# EasyEDA Pro project JLCEDA_AT_START_F456_V1.0.epro, board AT-START-F456 V1.0
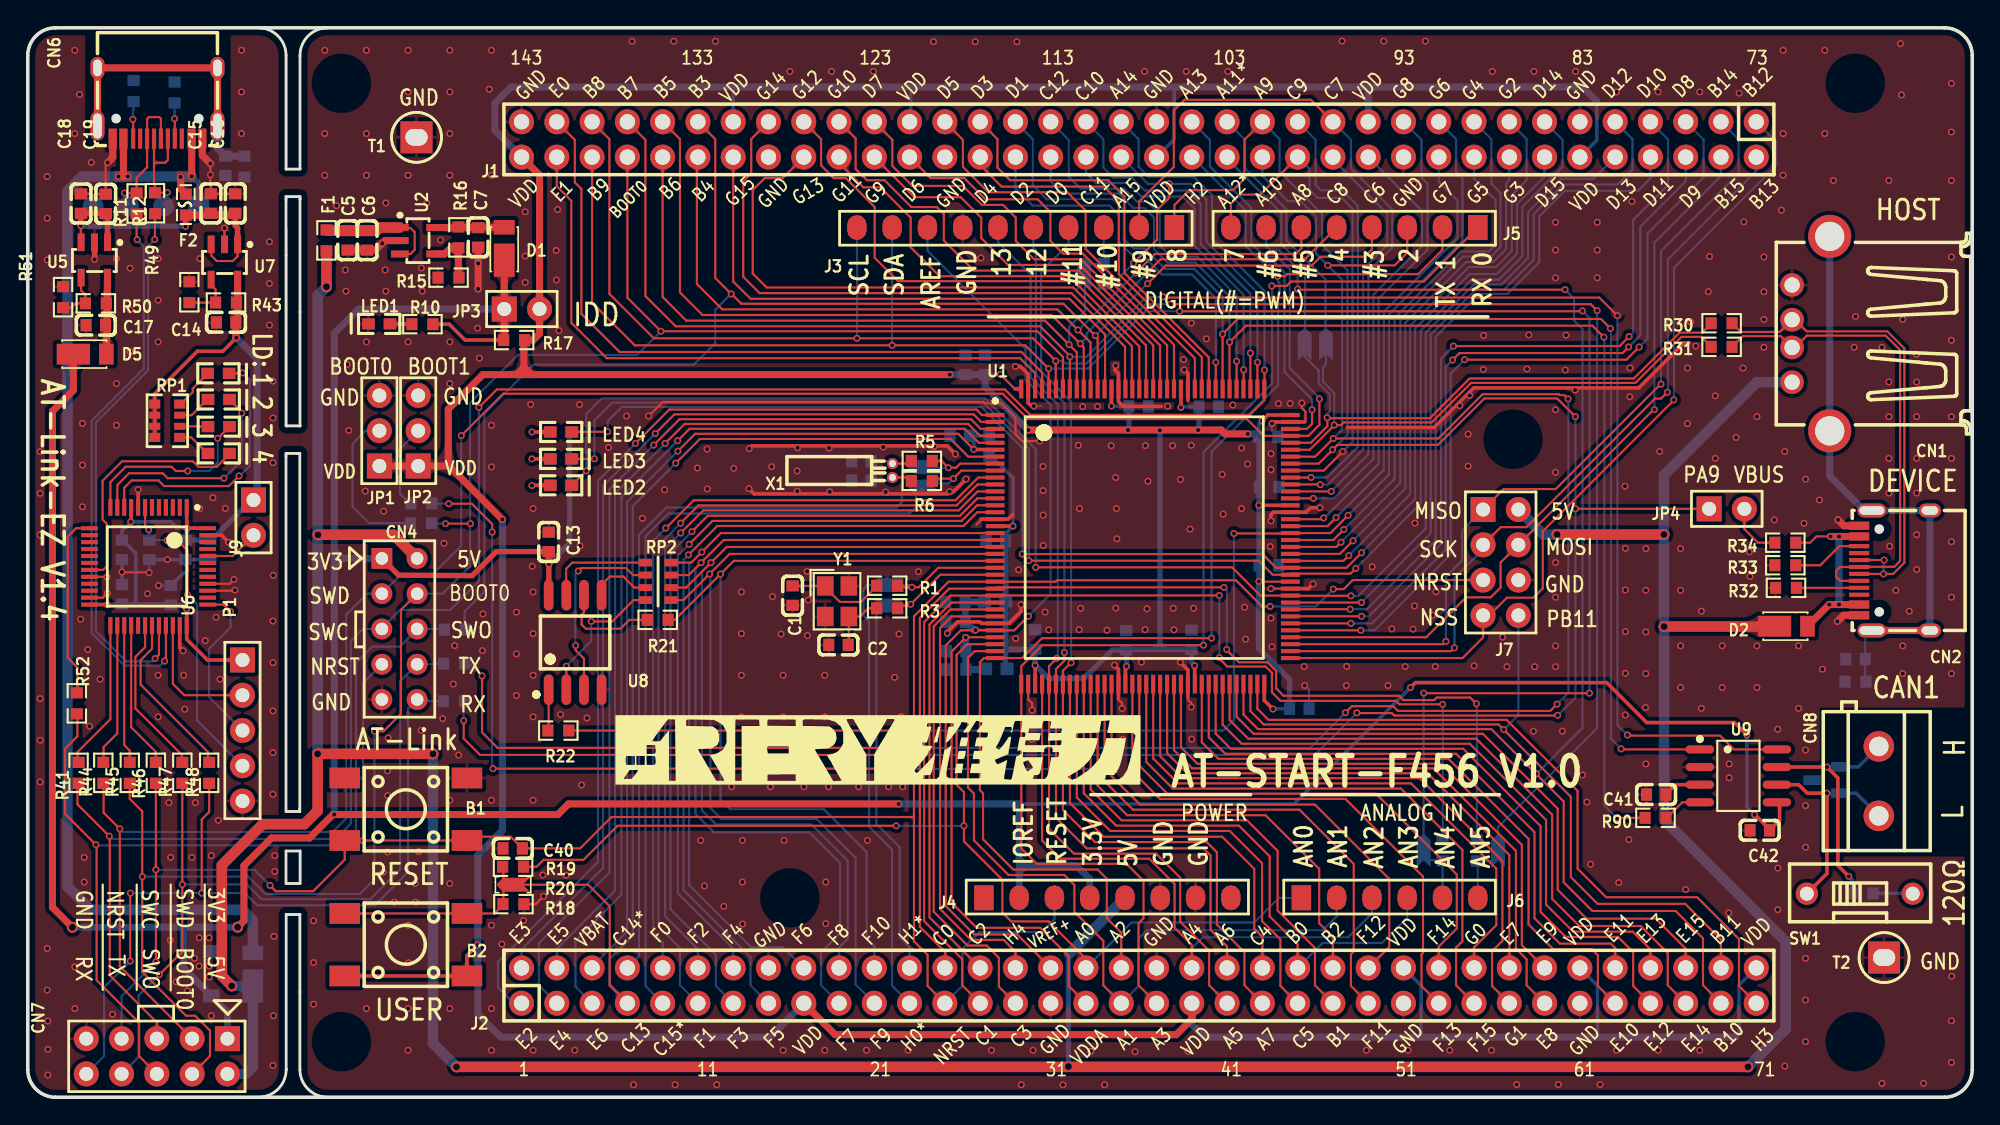
[diagram p4: board, top side]
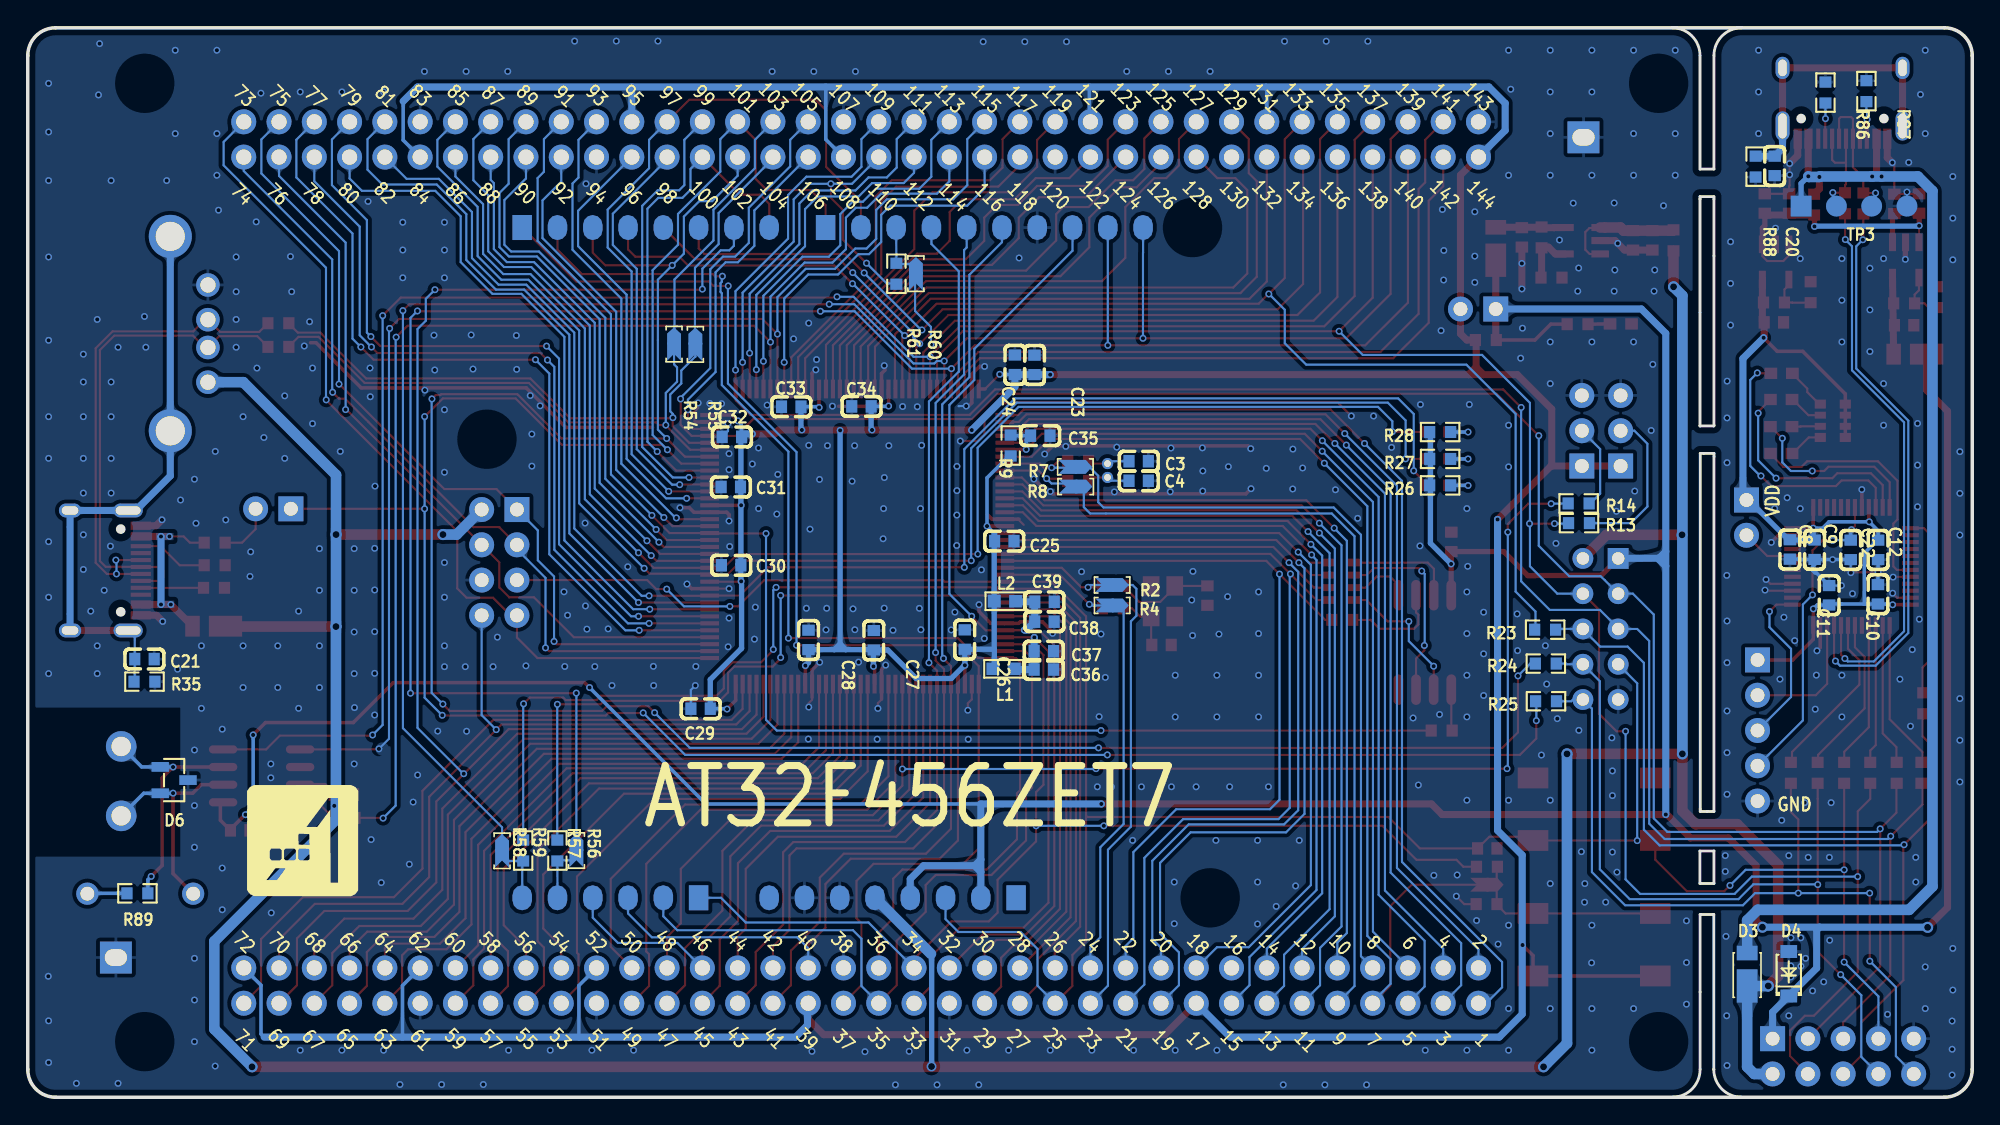
[diagram p5: board, bottom side, seen from below]

Outline 140 x 77 mm; copper layers: Top Layer, Bottom Layer. Coordinates in mm from the lower left corner of the outline.
Outline path: 16.6,77 arc(18.01,76.42) 18.6,75 18.6,66.83 19.6,66.83 19.6,75 arc(20.19,76.42) 21.6,77 ; 18.6,48.36 18.6,60.58 18.6,64.67 18.59,64.85 19.6,64.85 19.6,64.67 19.6,56.51 19.6,48.34 ; 18.6,48.36 18.62,48.34 ; 18.6,48.36 arc(18.6,48.34) 18.62,48.34 ; 18.62,48.34 19.59,48.34 ; 16.61,0 arc(18.02,0.59) 18.61,2 18.61,13.16 19.59,13.16 19.59,2 arc(20.18,0.59) 21.59,0 ; 19.59,48.34 19.6,48.34 ; 19.59,48.34 arc(19.6,48.34) 19.6,48.34 ; 0,75 0,2 arc(0.59,0.59) 2,0 138,0 arc(139.41,0.59) 140,2 140,75 arc(139.41,76.41) 138,77 2,77 arc(0.59,76.41) 0,75 ; 18.59,46.36 18.59,20.57 19.58,20.57 19.58,46.36 18.59,46.36 ; 18.59,17.73 18.59,15.39 19.61,15.39 19.61,17.73 18.59,17.73
Stack: Top Layer 0.035mm / Dielectric1 1.51mm FR4 er 4.5 / Bottom Layer 0.035mm

## Design rules (mm)
template: 自定义配置
spacing copperThickness1oz (default): track to track 0.152, other pairs 0.152 to 0.3
track width copperThickness1oz (default): min 0.152, default 0.152, max 2.54
differential pair differentialPair (default): width min 0.127, default 0.254, max 2.54; gap min 0.152, default 0.152
via viaSize (default): diameter min 0.5, default 0.5, max 0.8; hole min 0.3, default 0.3, max 0.5

## Placement (name value [footprint] x y rotation side)
B1  贴片按键6*6*5 黑色  [SW-SMD_4P-L6.0-W6.0-P4.50-LS9.0]  27.22 20.74 180 top
B2  贴片按键6*6*5 红色  [SW-SMD_4P-L6.0-W6.0-P4.50-LS9.0]  27.22 10.98 180 top
C1  15pF  [C0603]  55.07 36.12 90 top
C2  15pF  [C0603]  58.37 32.56 0 top
C3  18pF  [C0603]  60.02 45.8 0 bottom
C4  18pF  [C0603]  60.02 44.39 0 bottom
C5  10uF  [C0603]  23.03 61.7 270 top
C6  100nF  [C0603]  24.43 61.7 270 top
C7  10uF  [C0603]  32.43 61.91 270 top
C8  4.7uF  [C0603]  13.13 39.44 90 bottom
C9  100nF  [C0603]  11.35 39.42 90 bottom
C10  100nF  [C0603]  6.79 36.21 270 bottom
C11  100nF  [C0603]  10.3 36.14 270 bottom
C12  100nF  [C0603]  6.78 39.41 90 bottom
C13  100nF  [C0603]  37.51 39.99 90 top
C14  10uF  [C0603]  14.28 55.79 0 top
C15  10uF  [C0603]  13.18 64.35 270 top
C16  100nF  [C0603]  14.93 64.35 270 top
C17  10uF  [C0603]  4.9 55.59 0 top
C18  10uF  [C0603]  3.83 64.34 270 top
C19  100nF  [C0603]  5.61 64.32 270 top
C20  100nF  [C0603]  14.22 67.06 90 bottom
C21  100nF  [C0603]  131.6 31.55 180 bottom
C22  100nF  [C0603]  8.75 39.41 90 bottom
C23  4.7uF  [C0603]  67.51 52.73 90 bottom
C24  100nF  [C0603]  68.93 52.74 90 bottom
C25  100nF  [C0603]  69.69 40.04 180 bottom
C26  100nF  [C0603]  72.53 32.95 90 bottom
C27  100nF  [C0603]  79.09 32.9 90 bottom
C28  100nF  [C0603]  83.79 32.93 90 bottom
C29  100nF  [C0603]  91.56 27.97 0 bottom
C30  100nF  [C0603]  89.36 38.3 0 bottom
C31  100nF  [C0603]  89.38 43.94 0 bottom
C32  100nF  [C0603]  89.31 47.55 0 bottom
C33  100nF  [C0603]  85.03 49.72 0 bottom
C34  100nF  [C0603]  79.98 49.74 0 bottom
C35  100nF  [C0603]  67.1 47.63 180 bottom
C36  1uF  [C0603]  66.84 30.79 180 bottom
C37  100nF  [C0603]  66.84 32.11 180 bottom
C38  100nF  [C0603]  66.8 34.24 180 bottom
C39  1uF  [C0603]  66.79 35.67 180 bottom
C40  100nF  [C0603]  34.92 17.92 180 top
C41  100nF  [C0603]  117.25 21.79 0 top
C42  100nF  [C0603]  124.71 19.22 0 top
CN1  JTJ-USB-AF-08  [USB-A-TH__USB-AF-90]  128.38 54.98 90 top
CN2  -  [USB-C-SMD_TYPEC-304-BCP16]  134.41 37.93 90 top
CN4  CON10A_0  [HDR2X5]  25.49 38.8 270 top
CN6  -  [USB-C-SMD_TYPEC-304-BCP16]  9.34 71.57 180 top
CN7  CON10  [HDR2X5#2]  14.37 4.22 180 top
CN8  KF301-5.0-2P  [CONN-TH_P5.00_KF301-5.0-2P]  133.27 22.76 90 top
D1  DFLS130L-7  [POWERDI-123_L2.8-W1.8-LS3.7-RD]  34.31 61.45 90 top
D2  DFLS130L-7  [POWERDI-123_L2.8-W1.8-LS3.7-RD]  126.95 33.91 0 top
D3  DFLS130L-7  [POWERDI-123_L2.8-W1.8-LS3.7-RD]  16.21 9.19 90 bottom
D4  SMF3.3A  [SOD-123FL_L2.8-W1.8-LS3.8-RD]  13.21 8.89 90 bottom
D5  DFLS130L-7  [POWERDI-123_L2.8-W1.8-LS3.7-RD]  4.47 53.5 0 top
D6  PESD2CANFD24V-TR  [SOT-23-3_L2.9-W1.3-P1.90-LS2.4-BR]  129.46 22.83 0 bottom
F1  SMD0603B050TF  [R0603]  21.51 61.7 90 top
F2  BSMD0603-050-6V  [F0603]  11.38 64.27 270 top
J1  HDR 2X36  [HDR_2.54_2X36]  80 68.96 180 top
J2  HDR 2X36  [HDR_2.54_2X36]  80 8.04 0 top
J3  CON10  [FEMALE HEADER 1X10]  71.13 62.62 0 top
J4  CON8  [FEMALE HEADER 1X8]  77.73 14.36 0 top
J5  CON8  [FEMALE HEADER 1X8]  95.51 62.62 180 top
J6  CON6  [FEMALE HEADER 1X6]  98.05 14.36 0 top
J7  Header 4X2  [HDR2X4]  104.78 42.31 270 top
J9  1X2P_2.54M  [HDR1X2]  16.25 43 270 top
JP1  Jumper 1x3P  [HEADER 1X3]  25.31 45.45 90 top
JP2  Jumper 1x3P  [HEADER 1X3]  28.11 45.45 90 top
JP3  Jumper 1x2P  [HEADER 1X2]  34.31 56.75 0 top
JP4  Jumper 1x2P  [HEADER 1X2]  121.06 42.37 0 top
L1  0.5A,600Ω@100Mhz  [0603_L]  69.74 30.84 180 bottom
L2  0.5A,600Ω@100Mhz  [0603_L]  69.65 35.71 180 bottom
LD1  RED  [LED0603]  12.95 52.12 0 top
LD2  GREEN  [LED0603]  12.98 50.23 0 top
LD3  BLUE  [LED0603]  12.98 48.28 0 top
LD4  YELLOW  [LED0603]  12.98 46.35 0 top
LED1  RED  [LED0603]  26.08 55.69 180 top
LED2  RED  [LED0603]  37.63 44.05 0 top
LED3  YELLOW  [LED0603]  37.63 45.96 0 top
LED4  GREEN  [LED0603]  37.63 47.9 0 top
P1  Header 5  [HDR1X5]  15.46 31.48 270 top
R1  0Ω  [R0603]  61.87 36.83 0 top
R2  NC  [SB-PAD]  61.93 36.88 0 bottom
R3  0Ω  [R0603]  61.87 35.2 0 top
R4  NC  [SB-PAD]  61.93 35.41 0 bottom
R5  0Ω  [R0603]  64.37 45.82 0 top
R6  0Ω  [R0603]  64.37 44.38 0 top
R7  NC  [SB-PAD]  64.57 45.39 0 bottom
R8  NC  [SB-PAD]  64.55 43.97 0 bottom
R9  0Ω  [R0603]  69.23 46.92 270 bottom
R10  1kΩ  [R0603]  28.41 55.66 180 top
R11  0Ω  [R0603]  7.84 64.35 270 top
R12  0Ω  [R0603]  9.16 64.37 270 top
R13  10kΩ  [R0603]  28.31 41.33 0 bottom
R14  10kΩ  [R0603]  28.34 42.76 0 bottom
R15  15kΩ  [R0603]  30.29 59.01 180 top
R16  51kΩ  [R0603]  31 61.91 90 top
R17  0Ω  [R0603]  35.02 54.52 0 top
R18  100kΩ  [R0603]  34.97 13.9 180 top
R19  0Ω  [R0603]  34.94 16.59 0 top
R20  NC  [SB-PAD]  34.94 15.3 0 top
R21  33Ω  [R0603]  45.35 34.37 180 top
R22  33Ω  [R0603]  38.2 26.4 180 top
R23  470Ω  [R0603]  30.75 33.66 0 bottom
R24  470Ω  [R0603]  30.7 31.23 0 bottom
R25  470Ω  [R0603]  30.69 28.51 0 bottom
R26  1kΩ  [R0603]  38.31 44.05 180 bottom
R27  1kΩ  [R0603]  38.31 45.96 180 bottom
R28  1kΩ  [R0603]  38.31 47.9 180 bottom
R30  0Ω  [R0603]  121.96 55.73 0 top
R31  0Ω  [R0603]  121.96 54.03 0 top
R32  5.1kΩ  [R0603]  126.59 36.68 0 top
R33  5.1kΩ  [R0603]  126.54 38.3 0 top
R34  10kΩ  [R0603]  126.54 39.93 0 top
R35  1MΩ  [R0603]  131.6 29.92 0 bottom
R41  33Ω  [R0603]  3.66 23.36 270 top
R43  47kΩ  [R0603]  14.27 57.22 180 top
R44  33Ω  [R0603]  5.44 23.36 270 top
R45  33Ω  [R0603]  7.34 23.36 270 top
R46  33Ω  [R0603]  9.22 23.36 270 top
R47  33Ω  [R0603]  11.13 23.36 270 top
R48  33Ω  [R0603]  13.06 23.36 270 top
R49  15kΩ  [R0603]  11.63 57.96 90 top
R50  51kΩ  [R0603]  4.9 57.16 180 top
R51  15kΩ  [R0603]  2.54 57.61 90 top
R52  33Ω  [R0603]  3.53 28.36 270 top
R54  NC  [SB-PAD]  93.47 54.23 270 bottom
R55  NC  [SB-PAD]  91.93 54.21 270 bottom
R56  NC  [SB-PAD]  100.5 17.76 270 bottom
R57  0Ω  [R0603]  101.87 17.76 270 bottom
R58  NC  [SB-PAD]  105.85 17.74 270 bottom
R59  0Ω  [R0603]  104.33 17.76 270 bottom
R60  NC  [SB-PAD]  76.06 59.3 270 bottom
R61  0Ω  [R0603]  77.46 59.29 90 bottom
R86  5.1kΩ  [R0603]  10.57 72.34 90 bottom
R87  5.1kΩ  [R0603]  7.62 72.44 90 bottom
R88  1MΩ  [R0603]  15.6 67 270 bottom
R89  120Ω  [R0603]  132.11 14.68 180 bottom
R90  330Ω  [R0603]  117.2 20.12 0 top
RP1  1kΩ  [RES-ARRAY-SMD_0603-8P-L3.2-W1.6-BL]  10.04 48.71 270 top
RP2  33R  [0603*4,8P4R]  46.32 35.79 90 top
SW1  DSWB01LHGET  [SW-TH_DSWB01LHGET]  131.9 14.66 90 top
T1  TESTPOINT TP-5006  [TESTHOOK]  27.99 69.12 0 top
T2  TESTPOINT TP-5006  [TESTHOOK]  133.66 10.06 0 top
TP3  1X4P_2.54F  [HDR1X4 - TOP]  12.32 64.16 0 bottom
U1  AT32F457ZET7  [LQFP144_20*20]  80.28 40.37 0 top
U2  RT9080N-08GJ5  [SOT-23-5]  28.44 60.08 0 top
U5  RT9080N-08GJ5  [SOT-23-5]  3.2 59.9 270 top
U6  AT32F403ACCT7  [LQFP48 - 2]  11.45 42.47 270 top
U7  RT9080N-08GJ5  [SOT-23-5]  12.57 59.76 270 top
U8  EN25QH128A-104HIP  [SOIC-8_208MIL]  39.41 32.75 0 top
U9  MCP2562FD-E/SN  [SOIC-8_L4.9-W3.9-P1.27-LS6.0-BL]  123.16 23.14 270 top
X1  32.768kHz  [OSC-TH_BD2.0-P0.70-D0.3]  62.26 45.12 0 top
Y1  8MHz  [CRYSTAL-SMD_4P-L3.2-W2.5-BL]  58.27 35.71 270 top

## Footprints (pads in the part's own frame, mm; a bottom-side part is the same pattern mirrored in y, then rotated)
0603*4,8P4R
  rect 0.55x0.95 smd: 1(0,0) 4(2.7,0) 5(2.7,1.85) 8(0,1.85)
  rect 0.5x0.95 smd: 2(0.9,0) 3(1.8,0) 6(1.8,1.85) 7(0.9,1.85)
0603_L
  rect 0.93x0.9 smd: 1(-0.77,0) 2(0.77,0)
C0603
  rect 0.8x0.9 smd: 1(-0.7,0) 2(0.7,0)
CONN-TH_P5.00_KF301-5.0-2P
  round 2.2 hole 1.4: 1(-2.5,0) 2(2.5,0)
CRYSTAL-SMD_4P-L3.2-W2.5-BL
  rect 1.4x1.2 smd: 1(-1.1,-0.85) 2(1.1,-0.85) 3(1.1,0.85) 4(-1.1,0.85)
F0603
  rect 0.806x0.864 smd: 1(-0.753,0) 2(0.753,0)
FEMALE HEADER 1X6
  custom 1.4x1.8 hole 0.7x1: 1(-6.35,0) 2(-3.81,0) 3(-1.27,0) 4(1.27,0) 5(3.81,0) 6(6.35,0)
FEMALE HEADER 1X8
  custom 1.4x1.8 hole 0.7x1: 1(-8.89,0) 2(-6.35,0) 3(-3.81,0) 4(-1.27,0) 5(1.27,0) 6(3.81,0) 7(6.35,0) 8(8.89,0)
FEMALE HEADER 1X10
  custom 1.4x1.8 hole 0.7x1: 1(11.43,0) 2(8.89,0) 3(6.35,0) 4(3.81,0) 5(1.27,0) 6(-1.27,0) 7(-3.81,0) 8(-6.35,0) 9(-8.89,0) 10(-11.43,0)
HDR1X2
  rect 1.8x1.8 hole 1: 1(0,0)
  round 1.8 hole 1: 2(2.54,0)
HDR1X4 - TOP
  rect 1.5x1.5 smd: 1(0,0)
  round 1.5 smd: 2(-2.54,0) 3(-5.08,0) 4(-7.62,0)
HDR1X5
  rect 1.8x1.8 hole 1: 1(0,0)
  round 1.8 hole 1: 2(2.54,0) 3(5.08,0) 4(7.62,0) 5(10.16,0)
HDR2X4
  rect 1.8x1.8 hole 1.005x1: 1(0,0)
  round 1.8 hole 1.005x1: 2(0,2.54) 3(2.54,0) 4(2.54,2.54) 5(5.08,0) 6(5.08,2.54) 7(7.62,0) 8(7.62,2.54)
HDR2X5
  rect 1.5x1.5 hole 0.9: 1(0,0)
  round 1.5 hole 0.9: 2(0,2.54) 3(2.54,0) 4(2.54,2.54) 5(5.08,0) 6(5.08,2.54) 7(7.62,0) 8(7.62,2.54) 9(10.16,0) 10(10.16,2.54)
HDR2X5#2
  rect 1.8x1.8 hole 1: 1(0,0)
  round 1.8 hole 1: 2(0,2.54) 3(2.54,0) 4(2.54,2.54) 5(5.08,0) 6(5.08,2.54) 7(7.62,0) 8(7.62,2.54) 9(10.16,0) 10(10.16,2.54)
HDR_2.54_2X36
  round 1.8 hole 1.1: 1(-44.45,-1.27) 2(-44.45,1.27) 3(-41.91,-1.27) 4(-41.91,1.27) 5(-39.37,-1.27) 6(-39.37,1.27) 7(-36.83,-1.27) 8(-36.83,1.27) 9(-34.29,-1.27) 10(-34.29,1.27) 11(-31.75,-1.27) 12(-31.75,1.27) 13(-29.21,-1.27) 14(-29.21,1.27) 15(-26.67,-1.27) 16(-26.67,1.27) 17(-24.13,-1.27) 18(-24.13,1.27) 19(-21.59,-1.27) 20(-21.59,1.27) 21(-19.05,-1.27) 22(-19.05,1.27) 23(-16.51,-1.27) 24(-16.51,1.27) 25(-13.97,-1.27) 26(-13.97,1.27) 27(-11.43,-1.27) 28(-11.43,1.27) 29(-8.89,-1.27) 30(-8.89,1.27) 31(-6.35,-1.27) 32(-6.35,1.27) 33(-3.81,-1.27) 34(-3.81,1.27) 35(-1.27,-1.27) 36(-1.27,1.27) 37(1.27,-1.27) 38(1.27,1.27) 39(3.81,-1.27) 40(3.81,1.27) 41(6.35,-1.27) 42(6.35,1.27) 43(8.89,-1.27) 44(8.89,1.27) 45(11.43,-1.27) 46(11.43,1.27) 47(13.97,-1.27) 48(13.97,1.27) 49(16.51,-1.27) 50(16.51,1.27) 51(19.05,-1.27) 52(19.05,1.27) 53(21.59,-1.27) 54(21.59,1.27) 55(24.13,-1.27) 56(24.13,1.27) 57(26.67,-1.27) 58(26.67,1.27) 59(29.21,-1.27) 60(29.21,1.27) 61(31.75,-1.27) 62(31.75,1.27) 63(34.29,-1.27) 64(34.29,1.27) 65(36.83,-1.27) 66(36.83,1.27) 67(39.37,-1.27) 68(39.37,1.27) 69(41.91,-1.27) 70(41.91,1.27) 71(44.45,-1.27) 72(44.45,1.27)
HEADER 1X2
  rect 1.8x1.8 hole 1.005x1: 1(0,0)
  round 1.8 hole 1.005x1: 2(2.54,0)
HEADER 1X3
  rect 1.8x1.8 hole 1.005x1: 1(0,0)
  round 1.8 hole 1.005x1: 2(2.54,0) 3(5.08,0)
LED0603
  rect 0.914x0.813 smd: 1(-0.001,0.005) 2(1.548,0.005)
LQFP48 - 2
  rect 1.2x0.3 smd: 1(0,0) 2(0,-0.5) 3(0,-1) 4(0,-1.5) 5(0,-2) 6(0,-2.5) 7(0,-3) 8(0,-3.5) 9(0,-4) 10(0,-4.5) 11(0,-5) 12(0,-5.5) 25(8.5,-5.5) 26(8.5,-5) 27(8.5,-4.5) 28(8.5,-4) 29(8.5,-3.5) 30(8.5,-3) 31(8.5,-2.5) 32(8.5,-2) 33(8.5,-1.5) 34(8.5,-1) 35(8.5,-0.5) 36(8.5,0)
  rect 0.3x1.2 smd: 13(1.5,-7) 14(2,-7) 15(2.5,-7) 16(3,-7) 17(3.5,-7) 18(4,-7) 19(4.5,-7) 20(5,-7) 21(5.5,-7) 22(6,-7) 23(6.5,-7) 24(7,-7) 37(7,1.5) 38(6.5,1.5) 39(6,1.5) 40(5.5,1.5) 41(5,1.5) 42(4.5,1.5) 43(4,1.5) 44(3.5,1.5) 45(3,1.5) 46(2.5,1.5) 47(2,1.5) 48(1.5,1.5)
LQFP144_20*20
  rect 1.35x0.3 smd: 1(-10.625,8.75) 2(-10.625,8.25) 3(-10.625,7.75) 4(-10.625,7.25) 5(-10.625,6.75) 6(-10.625,6.25) 7(-10.625,5.75) 8(-10.625,5.25) 9(-10.625,4.75) 10(-10.625,4.25) 11(-10.625,3.75) 12(-10.625,3.25) 13(-10.625,2.75) 14(-10.625,2.25) 15(-10.625,1.75) 16(-10.625,1.25) 17(-10.625,0.75) 18(-10.625,0.25) 19(-10.625,-0.25) 20(-10.625,-0.75) 21(-10.625,-1.25) 22(-10.625,-1.75) 23(-10.625,-2.25) 24(-10.625,-2.75) 25(-10.625,-3.25) 26(-10.625,-3.75) 27(-10.625,-4.25) 28(-10.625,-4.75) 29(-10.625,-5.25) 30(-10.625,-5.75) 31(-10.625,-6.25) 32(-10.625,-6.75) 33(-10.625,-7.25) 34(-10.625,-7.75) 35(-10.625,-8.25) 36(-10.625,-8.75) 73(10.625,-8.75) 74(10.625,-8.25) 75(10.625,-7.75) 76(10.625,-7.25) 77(10.625,-6.75) 78(10.625,-6.25) 79(10.625,-5.75) 80(10.625,-5.25) 81(10.625,-4.75) 82(10.625,-4.25) 83(10.625,-3.75) 84(10.625,-3.25) 85(10.625,-2.75) 86(10.625,-2.25) 87(10.625,-1.75) 88(10.625,-1.25) 89(10.625,-0.75) 90(10.625,-0.25) 91(10.625,0.25) 92(10.625,0.75) 93(10.625,1.25) 94(10.625,1.75) 95(10.625,2.25) 96(10.625,2.75) 97(10.625,3.25) 98(10.625,3.75) 99(10.625,4.25) 100(10.625,4.75) 101(10.625,5.25) 102(10.625,5.75) 103(10.625,6.25) 104(10.625,6.75) 105(10.625,7.25) 106(10.625,7.75) 107(10.625,8.25) 108(10.625,8.75)
  rect 0.3x1.35 smd: 37(-8.75,-10.625) 38(-8.25,-10.625) 39(-7.75,-10.625) 40(-7.25,-10.625) 41(-6.75,-10.625) 42(-6.25,-10.625) 43(-5.75,-10.625) 44(-5.25,-10.625) 45(-4.75,-10.625) 46(-4.25,-10.625) 47(-3.75,-10.625) 48(-3.25,-10.625) 49(-2.75,-10.625) 50(-2.25,-10.625) 51(-1.75,-10.625) 52(-1.25,-10.625) 53(-0.75,-10.625) 54(-0.25,-10.625) 55(0.25,-10.625) 56(0.75,-10.625) 57(1.25,-10.625) 58(1.75,-10.625) 59(2.25,-10.625) 60(2.75,-10.625) 61(3.25,-10.625) 62(3.75,-10.625) 63(4.25,-10.625) 64(4.75,-10.625) 65(5.25,-10.625) 66(5.75,-10.625) 67(6.25,-10.625) 68(6.75,-10.625) 69(7.25,-10.625) 70(7.75,-10.625) 71(8.25,-10.625) 72(8.75,-10.625) 109(8.75,10.625) 110(8.25,10.625) 111(7.75,10.625) 112(7.25,10.625) 113(6.75,10.625) 114(6.25,10.625) 115(5.75,10.625) 116(5.25,10.625) 117(4.75,10.625) 118(4.25,10.625) 119(3.75,10.625) 120(3.25,10.625) 121(2.75,10.625) 122(2.25,10.625) 123(1.75,10.625) 124(1.25,10.625) 125(0.75,10.625) 126(0.25,10.625) 127(-0.25,10.625) 128(-0.75,10.625) 129(-1.25,10.625) 130(-1.75,10.625) 131(-2.25,10.625) 132(-2.75,10.625) 133(-3.25,10.625) 134(-3.75,10.625) 135(-4.25,10.625) 136(-4.75,10.625) 137(-5.25,10.625) 138(-5.75,10.625) 139(-6.25,10.625) 140(-6.75,10.625) 141(-7.25,10.625) 142(-7.75,10.625) 143(-8.25,10.625) 144(-8.75,10.625)
OSC-TH_BD2.0-P0.70-D0.3
  round 0.8 hole 0.5: 1(0,0.5) 2(0,-0.5)
POWERDI-123_L2.8-W1.8-LS3.7-RD
  rect 2.4x1.5 smd: 1(-1.188,0)
  rect 1.05x1.5 smd: 2(1.188,0)
R0603
  rect 0.806x0.864 smd: 1(-0.753,0) 2(0.753,0)
RES-ARRAY-SMD_0603-8P-L3.2-W1.6-BL
  rect 0.65x0.8 smd: 1(-1.2,-0.9) 4(1.2,-0.9) 5(1.2,0.9) 8(-1.2,0.9)
  rect 0.5x0.8 smd: 2(-0.4,-0.9) 3(0.4,-0.9) 6(0.4,0.9) 7(-0.4,0.9)
SB-PAD
  custom 1.226x1 smd: 1(-0.587,0)
  custom 1.319x1 smd: 2(0.54,0)
SOD-123FL_L2.8-W1.8-LS3.8-RD
  rect 0.93x1.2 smd: 1(-1.6,0) 2(1.6,0)
SOIC-8_208MIL
  oval 0.7x2.2 smd: 1(-1.905,-3.4) 2(-0.635,-3.4) 3(0.635,-3.4) 4(1.905,-3.4) 5(1.905,3.4) 6(0.635,3.4) 7(-0.635,3.4) 8(-1.905,3.4)
SOIC-8_L4.9-W3.9-P1.27-LS6.0-BL
  oval 0.588x2.045 smd: 1(-1.905,-2.772) 2(-0.635,-2.772) 3(0.635,-2.772) 4(1.905,-2.772) 5(1.905,2.772) 6(0.635,2.772) 7(-0.635,2.772) 8(-1.905,2.772)
SOT-23-3_L2.9-W1.3-P1.90-LS2.4-BR
  rect 1.25x0.7 smd: 1(1,-0.95) 2(1,0.95) 3(-1,0)
SOT-23-5
  rect 1.27x0.508 smd: 1(-1.651,2.54) 2(-1.651,1.6) 3(-1.651,0.635) 4(0.889,0.635) 5(0.889,2.54)
SW-SMD_4P-L6.0-W6.0-P4.50-LS9.0
  rect 2.2x1.5 smd: 1(-4.4,2.25) 2(-4.4,-2.25) 3(4.4,2.25) 4(4.4,-2.25)
SW-TH_DSWB01LHGET
  round 1.6 hole 1: 1(0,3.81) 2(0,-3.81)
TESTHOOK
  rect 2.3x2.3 hole 1.6x1.2: 1(0,0)
USB-A-TH__USB-AF-90
  round 1.7 hole 1.1: 1(-3.5,1.355) 2(-1,1.355) 3(1,1.355) 4(3.5,1.355)
  round 3.1 hole 2.1: SH1(7,-1.355) SH2(-7,-1.355)
USB-C-SMD_TYPEC-304-BCP16
  oval 1.001x2.1 hole 0.6x1.801: 13(-4.321,1.633) 14(4.321,1.633)
  oval 1.001x1.6 hole 0.6x1.199: 15(-4.321,-2.547) 16(4.321,-2.547)
  rect 0.6x1.45 smd: A1B12(-3.226,2.547) A4B9(-2.451,2.547) B1A12(3.22,2.547) B4A9(2.451,2.547)
  rect 0.299x1.45 smd: A5(-1.25,2.547) A6(-0.249,2.547) A7(0.249,2.547) A8(1.25,2.547) B5(1.75,2.547) B6(0.75,2.547) B7(-0.75,2.547) B8(-1.75,2.547)

## Nets
As in the schematic.

Pads without a net: CN2 A8 B8; CN6 A8 B8; J4 1 8; U6 2 3 4 5 6 14 15 16 17 18 21 22 29 38 41 42 43 45 46

## Via types
v1: diameter 0.5, hole 0.3, Top Layer to Bottom Layer, 364 vias
v2: diameter 0.5, hole 0.299, Top Layer to Bottom Layer, 419 vias
v3: diameter 0.8, hole 0.5, Top Layer to Bottom Layer, 12 vias
v4: diameter 0.7, hole 0.5, Top Layer to Bottom Layer, 1 via

## Routing (per net, layer and track width the routed paths; a pad name or vN(x,y) marks a point on that pad's centre or on a via; arc(x,y) is an arc through that point)
3V3: length 298.7
  Top Layer w0.254: v1(124.33,20.34) 124.36,20.34 125.26,19.44 125.26,19.37 C42.2 126.13,19.94 126.13,21.04 125.94,21.23 ; 29.11,55.66 30.34,55.66 31.49,54.52 34.32,54.52 ; v1(99.55,29.5) 99.91,29.85 113.69,29.85 116.56,26.97 122.89,26.97 v1(123.77,26.09)
  Top Layer w0.381: U8.8 v1(37.52,38.4) 37.51,38.41 37.51,39.29 33.73,39.29 32,37.56 26.69,37.59 25.49,38.8
  Top Layer w0.508: v3(3.21,12.23) 1.78,13.67 1.78,49.4 3.28,50.9 3.28,53.11 ; 34.3,60.26 34.3,54.53 34.32,54.52 ; 3.28,53.11 3.28,53.5 ; 3.28,53.11 3.79,53.62 ; v3(15.11,12.24) 15.56,12.7 15.56,16.68 17.55,18.67 20.29,18.67 21.98,20.35 v1(22.06,20.35) 38.17,20.35 38.93,21.12 v1(62.7,21.12)
  Bottom Layer w0.254: v1(124.33,20.34) 123.77,20.9 v1(123.77,26.09) ; 71.38,21.12 91.17,21.12 v1(99.55,29.5)
  Bottom Layer w0.381: v1(37.52,38.4) 39.01,39.89 39.01,47.9
  Bottom Layer w0.508: 71.38,17.12 71.38,16.21 ; 71.38,17.12 71.38,21.12 v1(62.7,21.12) ; 71.38,17.12 71.83,16.67 ; 71.38,16.21 71.83,16.67 ; 71.38,16.21 71.38,14.36 ; 22.06,39.3 22.06,55 23.82,56.75 34.3,56.75 ; 22.06,39.3 22.06,38.23 ; 22.06,39.3 22.55,38.81 ; 25.49,38.8 22.55,38.81 ; 22.55,38.81 22.55,38.72 22.06,38.23 ; 71.83,16.67 75.51,16.67 76.46,15.72 76.46,14.36 ; 22.06,38.23 v1(22.06,20.35) ; 11,12.24 3.22,12.24 v3(3.21,12.23) ; 11,12.24 11.2,12.04 11.2,9.3 D4.1 14.37,6.12 CN7.1 ; 11,12.24 v3(15.11,12.24)
5V: length 295.9
  Top Layer w0.254: U9.3 118.61,22.5 117.95,21.84 C41.2 117.95,20.99 v1(117.93,20.98)
  Top Layer w0.762: v3(117.81,33.89) 125.74,33.89 D2.1 ; v3(117.81,40.51) v3(110.11,40.51) 110.08,40.54 ; v3(29.18,24.72) v3(20.87,24.72) 20.87,20.62 19.91,19.66 16.92,19.66 13.97,16.71 13.97,8.73 v3(14.68,8.02) ; v3(123.85,2.19) v3(30.87,2.19) ; 28.03,38.8 26.33,40.5 v3(20.89,40.5) ; 21.51,60.94 21.51,58.35
  Bottom Layer w0.381: v4(74.93,2.21) 74.92,2.22 74.92,10.27 74.97,10.32
  Bottom Layer w0.762: v3(21.5,58.35) 20.87,57.72 v3(20.87,24.72) ; 29.18,24.72 29.18,3.88 v3(30.87,2.19) ; J7.2 109.12,40.51 v3(110.11,40.51) ; 127.03,51.48 124.48,51.48 117.81,44.81 v3(117.81,40.51) 117.81,33.89 v3(117.81,33.89) 117.81,19.98 126.57,11.22 126.57,4.9 v3(123.85,2.19) ; CN7.2 15.7,1.68 16.21,2.18 D3.1 14.69,8.01 v3(14.68,8.02) ; 79,14.36 74.97,10.32
GND: length 186.6
  Top Layer w0.152: 78.79,28.37 v2(78.79,27.99) ; v1(13.15,67.23) v2(13.15,66.42) 13.15,65.64 13.18,65.6 13.18,65.05 14.93,65.05 ; v2(72.31,27.86) 72.31,28.36 72.03,28.64 72.03,29.75 ; v1(5.73,36.29) 5.41,35.97 U6.23 ; v1(14.16,62.58) 14.17,62.57 U7.2 ; v1(5.75,67.29) 5.61,67.15 C19.1 5.59,65.04 C18.1 ; v2(72.86,47.25) 71.62,47.25 71.11,47.76 71.11,48.94 70.09,49.96 68.92,49.96 68.82,50.06 45.72,50.06 v2(44.7,49.05) ; v2(37.14,14.48) 36.57,13.9 R18.1 ; 78.79,28.38 78.53,28.63 78.53,29.75 ; v2(83.77,28.09) 83.77,28.38 83.53,28.62 83.53,28.79 ; v1(6.78,37.82) 6.8,37.8 8.71,37.8 v1(8.74,37.77) ; v1(5.7,37.45) 5.68,37.47 U6.20 ; v1(14.85,37.28) 14.54,36.97 U6.40 ; U1.83 v2(89.51,36.62) ; 68.7,41.62 68.29,41.21 ; v2(91.73,49.99) 91.73,49.62 91.99,49.37 91.99,48.67 91.94,48.62 ; U6.39 14.87,36.47 v1(14.92,36.51)
  Top Layer w0.254: v2(71.11,52.62) 71.47,52.62 72.03,52.06 U1.143 72.03,50 72.22,49.81 ; v2(89.59,48.51) 89.59,48.62 U1.107 91.94,48.62 ; U6.47 13.94,40.48 v1(14.47,39.95) ; v2(67.56,44.51) 66.66,43.61 v2(66.37,43.61) 66.21,43.44 61.91,43.44 ; 95.01,48.23 101.26,48.23 104.11,51.07 115.99,51.07 119.24,54.32 119.64,54.32 ; v2(82.98,31.32) 83.53,30.77 83.53,28.79 ; 68.63,41.62 U1.16 70.58,41.62 70.92,41.96 ; v1(7.95,43.75) 7.95,42.47 7.94,42.47 ; 83.53,50.16 83.53,52.12 83.44,52.21 ; 61.91,43.44 52.3,43.44 v2(51.93,43.81) ; 61.91,43.44 v2(61.77,43.58) ; 78.53,28.67 78.53,30.82 v2(78.23,31.11) ; 66.26,33.55 66.94,34.23 68.55,34.23 68.66,34.12 U1.31 70.66,34.12 71.51,34.97 v2(71.51,35.46) ; v2(66.79,46.31) 66.2,46.9 52.14,46.9 v2(51.95,46.7) ; v1(11.18,32.15) 10.95,32.38 U6.35 ; 81.62,49.75 78.86,49.75 78.53,50.08 78.53,52.11 78.29,52.35 78.29,52.72 ; v2(89.51,41.49) 89.5,41.5 89.5,41.94 89.68,42.12 U1.94 92.04,42.12 92.36,42.44 v1(93.04,42.44) ; 90.91,36.62 92.2,36.62 v2(92.54,36.95)
  Top Layer w0.381: 4.8,61.56 4.82,61.54 v1(4.82,60.33)
  Top Layer w0.508: v2(130.29,34.26) 130.73,34.7 CN2.A1B12 ; CN6.B1A12 6.12,67.66 v1(5.75,67.29) ; CN6.A1B12 12.56,67.81 v1(13.15,67.23) ; U2.2 25.72,61.68 v2(25.52,61.48) 25.04,61 C6.2 C5.2 ; v2(130.34,41.57) 130.77,41.15 CN2.B1A12 ; 32.43,58.2 v2(32.43,58.2) v2(32.43,60.04) 32.43,61.21
  Bottom Layer w0.152: v2(72.43,49.77) 72.96,49.77 72.98,49.75 ; v1(8.74,37.77) 8.75,37.78 C22.1 ; v2(4.7,65.18) TP3.4 ; v2(91.94,29.64) 92.26,29.32 C29.2 ; C32.2 89.59,47.97 v2(89.59,48.51) ; C11.1 v1(9.42,36.84)
  Bottom Layer w0.254: C11.1 11.22,37.75 11.32,37.75 11.5,37.93 11.5,38.19 11.35,38.34 11.35,38.71 ; C22.1 v1(10.05,38.71) 11.35,38.71 ; 11.35,38.71 12.39,38.71 12.42,38.74 C8.1 ; 11.35,38.71 C9.1 ; C10.1 6.79,37.81 v1(6.78,37.82) C12.1
  vias: v1(57.69,46.74) v1(83.77,55.74) v1(84.86,54.6) v1(103.11,49.78) v1(103.82,50.52) v1(106.5,31) v1(108.41,26.35) v1(108.5,31) v1(110,63) v1(110,61) v1(110,59) v1(110,49.5) v1(110,45) v1(110,38.5) v1(110,36) v1(110,32.5) v1(110,31) v1(110.7,52.36) v1(110.75,54.87) v1(111.41,50.91) v1(111.93,23.2) v1(112.26,21.25) v1(112.53,16.78) v1(113,63) v1(113,61) v1(113,59) v1(115,44) v1(115.02,39.52) v1(115.02,36.52) v1(115.02,33.52) v1(115.02,30.52) v1(115.02,27.52) v1(115.28,18.55) v1(115.36,52.5) v1(115.34,50.44) v1(115.5,64.5) v1(116.5,39.5) v1(116.5,36.5) v1(116.5,33.5) v1(116.5,30.5) v1(116.48,28.05) v1(116.5,24) v1(117.5,46.5) v1(119,39.5) v1(119,36.5) v1(119,32.5) v1(119,29.5) v1(119.5,52.5) v1(119.5,48.5) v1(119.71,55.84) v1(120.09,54.09) v1(120.5,35) v1(120.5,28) v1(121,58) v1(121.5,50.5) v1(121.5,46) v1(122,32.5) v1(122,29.5) v1(122.5,24) v1(122.5,23) v1(123,47.5) v1(123.5,52.5) v1(123.95,39.27) v1(124,37.5) v1(124.5,49) v1(124.5,32.5) v1(124.5,29.5) v1(125,60.5) v1(125,58) v1(125,56) v1(125,54) v1(125.75,41.57) v1(126,26.5) v1(126,16.5) v1(126,13.5) v1(126.5,46.5) v1(127.5,32.5) v1(127.5,28) v1(127.89,41.33) v1(128,44.5) v1(128,25) v1(128,21) v1(128,18) v1(128,10) v1(128,7) v1(128,4) v1(129,43) v1(130,66) v1(131.5,54) v1(131.6,56.22) v1(133.5,54) v1(133.5,1) v1(134,66) v1(134,51.5) v1(134,49) v1(134,46) v1(134,43.5) v1(134.05,39.68) v1(134.5,36.5) v1(135,56) v1(135,32.5) v1(135,30.5) v1(135.47,35) v1(136,53.5) v1(136,51.5) v1(136,49) v1(136,46) v1(136,43.5) v1(136,40.5) v1(136,38) v1(136.5,1) v1(138.5,73) v1(138.5,69.5) v1(138.5,66) v1(138.5,60.5) v1(138.5,54.5) v1(138.5,49) v1(138.5,46) v1(138.5,40) v1(138.5,36) v1(138.5,30.5) v1(138.5,5.5) v1(138.5,2.5) v2(0.89,46.48) v2(0.89,43.48) v2(0.89,40.48) v2(0.89,28.7) v2(0.89,25.7) v2(0.89,22.7) v2(1.4,66.29) v2(1.4,63.29) v2(1.4,60.29) v2(1.4,10.72) v2(1.4,7.72) v2(1.45,5.49) v2(1.45,3.45) v2(1.45,1.6) v2(3.38,75.38) v2(3.38,69.38) v2(3.38,9.38) v2(3.38,6.38) v2(3.72,72.2) v2(3.81,34.42) v2(3.94,48.51) v2(3.94,45.51) v2(3.94,42.51) v2(4.06,17.27) v2(4.06,15.49) v2(4.32,32.23) v2(4.44,26.72) v2(4.57,67.31) v2(5.21,30.1) v2(6.1,5.97) v2(6.38,60.38) v2(6.38,51.38) v2(6.38,48.38) v2(7.37,59.69) v2(7.37,56.69) v2(7.37,53.69) v2(8.62,36.26) v2(9.38,60.38) v2(9.38,57.38) v2(9.38,54.38) v2(9.38,30.38) v2(9.38,27.38) v2(10.16,21.21) v2(10.29,17.27) v2(10.26,11.3) v2(10.69,8.31) v2(11.22,30.39) v2(11.3,27.94) v2(11.49,7.66) v2(11.81,17.27) v2(12,10) v2(12.06,21.21) v2(12.38,60.38) v2(12.38,42.38) v2(12.34,11.48) v2(12.33,9.44) v2(12.78,32.88) v2(13.06,11.48) v2(13.06,9.45) v2(13.06,8.66) v2(13.21,17.4) v2(13.21,5.87) v2(13.33,43.16) v2(13.56,34.56) v2(13.72,19.94) v2(13.84,30.1) v2(14.22,42.39) v2(15.38,75.38) v2(15.38,72.38) v2(15.38,69.38) v2(17.4,61.59) v2(17.4,58.59) v2(17.4,55.59) v2(17.64,51.56) v2(17.65,48.91) v2(17.65,45.69) v2(17.67,37.57) v2(17.65,34.29) v2(17.65,31.29) v2(17.65,27.81) v2(17.65,24.81) v2(17.65,21.81) v2(17.68,5.87) v2(17.65,2.29) v2(17.78,17.4) v2(17.78,16.26) v2(17.73,11.58) v2(20.57,12.7) v2(20.57,9.7) v2(20.57,6.7) v2(21.38,75.38) v2(21.38,69.38) v2(21.38,66.38) v2(22.23,64.19) v2(22.86,59.56) v2(22.91,58.04) v2(23,52.77) v2(23.11,48.01) v2(24.3,43.64) v2(24.38,75.38) v2(24.38,69.38) v2(24.38,66.38) v2(24.38,54.38) v2(24.38,6.38) v2(25.62,42.19) v2(25.58,16.21) v2(25.78,64.39) v2(25.73,59.56) v2(25.78,58.04) v2(25.91,23.5) v2(25.91,21.72) v2(25.91,17.65) v2(25.95,25.88) v2(26.39,14.05) v2(27.38,75.38) v2(27.38,72.38) v2(27.38,66.38) v2(27.38,54.38) v2(27.38,12.38) v2(27.41,9.68) v2(27.38,6.38) v2(27.38,3.38) v2(27.89,15.38) v2(27.91,14.05) v2(28.14,17.68) v2(28.32,26.42) v2(28.34,59.7) v2(28.4,58.04) v2(28.73,64.38) v2(29.72,61.72) v2(29.88,27.26) v2(29.97,39.88) v2(30.38,75.38) v2(30.38,72.38) v2(30.38,69.38) v2(30.38,66.38) v2(30.38,54.38) v2(30.38,51.38) v2(30.38,21.38) v2(30.38,15.38) v2(30.38,6.38) v2(30.64,29.75) v2(30.73,32.51) v2(31.02,24.64) v2(32.38,55.37) v2(32.51,53.21) v2(32.77,34.8) v2(32.73,32.16) v2(33.23,72.58) v2(33.38,75.38) v2(33.38,66.38) v2(33.38,48.38) v2(33.38,45.38) v2(33.38,21.38) v2(33.38,12.38) v2(33.38,6.38) v2(33.38,3.38) v2(34.14,11.02) v2(35.18,34.92) v2(35.18,31.92) v2(35.18,28.92) v2(35.69,12.72) v2(35.81,63.75) v2(35.81,60.56) v2(35.81,58.67) v2(36.21,49.88) v2(36.32,38.23) v2(36.38,42.38) v2(36.38,36.38) v2(36.38,33.38) v2(36.38,30.38) v2(36.38,27.38) v2(36.38,21.38) v2(36.38,3.38) v2(37.08,16) v2(38.04,60.97) v2(38.06,58.84) v2(38.15,63.92) v2(38.24,55.2) v2(38.35,27.56) v2(38.76,15.98) v2(39.38,3.38) v2(39.73,49.88) v2(39.77,39.7) v2(39.88,22.48) v2(40.26,27.31) v2(41.81,46.79) v2(43.1,49.05) v2(43.51,76.03) v2(43.61,0.89) v2(44.25,41.68) v2(45.85,43.74) v2(46.51,76.03) v2(46.61,0.89) v2(48.21,45.31) v2(48.45,18.49) v2(48.72,15.21) v2(48.91,46.67) v2(48.93,43.8) v2(49.51,76.03) v2(49.61,0.89) v2(50.11,13.74) v2(50.67,22.35) v2(50.83,45.28) v2(51.38,36.38) v2(51.38,33.38) v2(51.38,30.38) v2(51.38,27.38) v2(51.45,18.49) v2(51.45,15.49) v2(51.46,12.47) v2(53.47,22.35) v2(53.56,45.4) v2(53.61,36.04) v2(54.23,33.34) v2(54.38,30.38) v2(54.38,27.38) v2(54.38,3.38) v2(54.45,18.49) v2(54.87,73.86) v2(55.4,45.09) v2(55.4,43.65) v2(55.43,46.75) v2(55.88,22.35) v2(56.11,37.86) v2(56.19,35.8) v2(56.14,33.24) v2(57.38,30.38) v2(57.38,27.38) v2(57.38,3.38) v2(57.45,15.49) v2(57.45,12.49) v2(57.66,22.35) v2(57.74,43.59) v2(57.87,73.86) v2(59.82,22.35) v2(60.38,3.38) v2(60.45,18.49) v2(60.87,73.86) v2(61.59,46.81) v2(61.98,22.35) v2(62.42,30.23) v2(62.73,33.35) v2(62.86,27.4) v2(62.99,22.35) v2(63.38,3.38) v2(64.13,37.84) v2(65.21,76) v2(65.26,46.86) v2(66.21,33.4) v2(66.38,3.38) v2(68.21,76) v2(68.62,60.43) v2(69.38,3.38) v2(71.21,76) v2(71.13,33.03) v2(71.34,37.97) v2(71.53,0.89) v2(72.29,25.77) v2(72.38,3.38) v2(73.1,45.42) v2(73.1,43.68) v2(73.11,41.92) v2(73.12,39.73) v2(73.25,34.93) v2(73.51,33.65) v2(74.53,0.89) v2(75.64,46.94) v2(75.7,33.66) v2(75.73,42.38) v2(75.81,35.2) v2(75.96,49.72) v2(76.54,3.3) v2(77.01,49.73) v2(77.53,0.89) v2(77.71,33.62) v2(78,46.91) v2(78.33,52.68) v2(78.33,44.62) v2(78.38,42.38) v2(78.42,40.21) v2(78.34,35.22) v2(78.84,25.78) v2(79.72,3.28) v2(80.19,31.33) v2(80.41,73.86) v2(80.47,46.91) v2(80.45,33.66) v2(80.58,35.16) v2(80.65,44.35) v2(82.07,49.76) v2(82.42,46.91) v2(82.48,35.2) v2(82.53,33.65) v2(83,44.48) v2(83.21,53.11) v2(83.26,52.38) v2(83.41,73.86) v2(83.54,3.3) v2(83.68,40.9) v2(83.77,46.94) v2(83.8,25.79) v2(83.94,35.2) v2(86,44.85) v2(86.07,41.99) v2(86.41,73.86) v2(86.77,49.83) v2(87.39,46.75) v2(87.38,42.38) v2(87.61,35.29) v2(87.68,32.98) v2(87.83,45.59) v2(89.51,46.34) v2(89.51,45.18) v2(89.46,39.65) v2(89.51,34.5) v2(89.58,32.43) v2(90.05,49.94) v2(90.89,49.95) v2(91.9,31.02) v2(94.63,76.04) v2(94.96,31.02) v2(94.94,29.64) v2(96.38,3.38) v2(96.8,38.19) v2(97.63,76.04) v2(97.94,29.64) v2(98.21,33.72) v2(99.17,31.01) v2(99.38,3.38) v2(99.81,65.77) v2(99.74,33.7) v2(99.87,41.34) v2(99.85,35.37) v2(100.63,76.04) v2(101.14,34.71) v2(101.39,36.39) v2(101.34,31.02) v2(102.38,3.38) v2(103.71,47.75) v2(103.7,45.44) v2(104.13,31.06) v2(104.82,54.85) v2(104.8,52.41) v2(105.38,3.38) v2(105.44,73.86) v2(106.19,33.13) v2(107.2,0.91) v2(107.94,52.43) v2(108.08,54.89) v2(108.44,73.86) v2(110.2,0.91) v2(110.48,26.36) v2(111.44,73.86) v2(113.2,0.91) v2(114.38,72.38) v2(114.38,3.38) v2(114.55,15.45) v2(117.38,72.38) v2(117.38,3.38) v2(119.37,14.95) v2(120.38,72.38) v2(120.38,3.38) v2(121.09,60.53) v2(122.47,13.28) v2(123.21,72.3) v2(123.55,63.03) v2(126.27,63.87) v2(126.38,75.38) v2(126.38,69.38) v2(126.38,66.38) v2(126.51,2.24) v2(129.22,30.82) v2(129.38,75.38) v2(129.38,69.38) v2(134.83,75.86) v2(134.91,72.17) v2(138.52,8.71)
VBAT: length 69.1
  Top Layer w0.152: U1.6 68.14,46.62 68.11,46.64 66.99,47.77 48.05,47.77 46.8,46.52
  Top Layer w0.254: 68.11,46.64 U1.6
  Bottom Layer w0.152: 46.8,46.52 43.15,42.86 43.15,11.92 40.63,9.41 J2.6 ; 69.23,47.62 69.22,47.63 C35.1
  Bottom Layer w0.254: 69.23,47.62 67.79,47.63 68.11,47.32 68.11,46.64
  vias: v1(46.8,46.52) v1(68.11,46.64)
VBUS: length 14
  Top Layer w0.152: R34.2 128.33,39.93 128.78,40.38 v2(129.8,40.38)
  Top Layer w0.508: CN2.A4B9 v2(130.41,35.48) v2(129.7,35.48) D2.2 ; CN2.B4A9 v2(129.8,40.38)
  Bottom Layer w0.508: v2(130.41,35.48) v2(130.41,40.37) 130.42,40.38
VCC: length 63.2
  Top Layer w0.254: v1(7.42,41.43) 7.45,41.46 U6.9 ; 11.44,33.97 11.44,32.97 12.93,31.48 P1.1 ; v1(15.02,54.68) 14.04,53.71 12.2,53.71 9.14,50.64 RP1.1 RP1.2 9.14,47.51 ; 11.44,42.47 11.44,41.45 11.45,41.44 v1(11.45,40.97) 11.95,40.97 11.96,40.97 12.95,40.97 ; U6.36 11.45,35.16 v1(11.44,35.16) ; v1(5.73,35.46) 5.72,35.47 4.44,35.47
  Top Layer w0.508: U7.5 15.11,55.92 C14.2 14.98,54.72 v1(15.02,54.68)
  Bottom Layer w0.152: C10.2 6.84,35.51
  Bottom Layer w0.254: v1(5.73,35.46) 6.13,35.46 6.18,35.51 C10.2 ; 7.78,35.51 9.4,35.51 9.41,35.52 10.22,35.52 C11.2 11.16,35.44 v1(11.44,35.16) ; 7.78,35.51 6.84,35.51 ; 7.78,35.51 7.77,35.52 7.77,39.17 6.83,40.11 C12.2 6.78,40.79 v1(7.42,41.43) 10.31,41.43 10.77,40.97 v1(11.45,40.97)
  Bottom Layer w0.381: v1(11.45,40.97) 11.45,40.22 11.35,40.12 13.11,40.12 C8.2 13.24,40.14 16.1,43 J9.1
  Bottom Layer w0.508: J9.1 16.51,43.26 16.51,53.19 v1(15.02,54.68)
VCC3.5V: length 5.5
  Top Layer w0.508: D5.2 U5.5
VDD: length 461.8
  Top Layer w0.152: 71.08,50.99 70.02,52.05 ; 78.02,49.77 78.02,50.98 78.03,50.99 ; 84.03,29.75 84.03,31.06 84.01,31.07 ; 90.91,37.12 88.66,37.12 v1(88.64,37.14) ; v1(83.03,49.67) 83.03,50.99 83.03,50.99
  Top Layer w0.254: v1(32.38,10.96) 31.62,10.2 B2.1 B2.3 ; v1(88.87,48.7) 89.29,49.12 U1.108 ; 79.03,29.75 79.03,30.94 v1(79.11,31.02) ; U1.17 70.93,41.12 ; 84.03,29.75 84.01,31.07 ; 71.53,50.99 71.08,50.99 ; 89.03,29.75 89.03,28.57 89.65,27.95 ; U1.95 v1(88.64,42.62) ; 78.03,50.99 78.02,49.77 ; 83.03,50.99 v1(83.03,49.67) ; 72.53,29.75 72.53,31.1 ; 90.9,37.12 U1.84
  Top Layer w0.508: 36.26,52.03 35.2,52.03 ; 36.26,52.03 66.39,52.03 ; 36.26,52.03 35.72,52.57 ; 35.2,52.03 35.72,52.57 ; 35.2,52.03 32.76,52.03 30.28,49.55 30.28,45.45 ; JP1.1 30.28,45.45 ; J1.72 36.85,66.4 JP3.2 ; 30.28,45.45 30.33,45.45 v1(34.18,41.6) ; J2.39 83.81,5.62 82.69,4.5 58.13,4.5 J2.17 ; 35.72,52.57 35.72,54.52 36.39,54.52 36.84,54.97 36.84,56.75 ; v2(87.84,47.76) 86.21,47.76 85.93,48.04 v1(84.27,48.04) v1(79.21,48.04) ; 79.22,48.04 72.04,48.04 v1(72.04,48.03)
  Bottom Layer w0.152: 89.68,27.97 89.65,27.95 ; 88.61,47.73 88.61,47.55 ; 78.02,49.77 78.04,49.74
  Bottom Layer w0.254: v1(83.03,49.67) 83.07,49.72 C33.1 ; J1.12 112.97,68.91 112.97,71.71 ; J2.72 123.21,8.06 123.21,4.56 122.98,4.33 ; C24.1 70,52.04 v1(70.02,52.05) ; v1(88.87,48.7) 88.63,48.47 88.63,47.76 ; J2.52 100.32,8.04 100.32,4.33 ; J1.36 82.54,68.96 82.54,72.74 ; C29.1 89.68,27.97 89.65,27.95 ; 50.85,72.74 50.79,72.68 J1.59 ; 79.28,49.74 78.02,49.74 ; 88.95,38.36 88.72,38.36 C30.1 ; J2.62 113.02,8.04 113.02,4.33 ; 70.39,40.57 70.93,41.12 70.93,44.59 69.3,46.22 69.23,46.22 ; 63.57,72.74 63.57,70.31 J1.49
  Bottom Layer w0.381: 70.41,32.25 70.41,30.95 L1.1 ; 70.41,32.25 70.42,32.26 L2.1 70.42,40.55 70.39,40.57 ; 70.41,32.25 72.53,32.25 72.53,31.12 73.51,30.15 76.03,30.15 78.08,32.2 79.09,32.2 ; 79.22,48.04 79.28,48.04 79.28,49.74 ; 84.02,31.07 83.79,31.3 83.79,32.23 81.93,32.23 ; 81.93,32.23 81.51,32.65 ; 81.93,32.23 81.1,32.23 ; C33.1 84.33,48.1 v1(84.27,48.04) ; 79.11,32.18 v1(79.11,31.02) ; 88.66,37.14 C30.1 88.66,47.55 ; v1(81.51,48.02) 81.51,32.65 ; 81.51,32.65 81.1,32.23 ; 88.61,36.93 88.61,32.32 90.86,30.07 C29.1 ; 81.1,32.23 79.09,32.23
  Bottom Layer w0.508: 96.51,72.74 34.8,72.74 33.63,71.57 33.63,69.62 J1.72 ; 96.51,72.74 111.94,72.74 112.97,71.71 ; 96.51,72.74 J1.23 ; 122.98,4.33 84.72,4.33 83.86,5.19 83.86,6.72 J2.39 ; v1(34.18,41.6) 34.18,19.21 32.4,17.43 32.4,5.98 34.05,4.33 53.43,4.33 J2.17 ; v1(72.04,48.03) 68.93,51.14 C24.1 68.92,52.03 v1(66.39,52.03) ; v2(87.84,47.76) 88.61,47.76
  vias: v1(70.94,41.12) v1(72.53,31.1) v1(78.02,49.77) v1(84.01,31.07) v1(89.65,27.95)
VDDA: length 40.4
  Top Layer w0.152: J2.33 74.95,8.01 74.95,10.15 72.89,12.2 68.32,12.2 66.51,14.01 66.51,32.09 67.55,33.12 U1.33
  Bottom Layer w0.152: 67.53,33.11 67.54,33.09 67.54,32.11 ; 68.92,30.79 68.97,30.84
  Bottom Layer w0.508: 67.53,33.11 67.54,32.11 67.54,30.79 68.92,30.79 ; 68.97,30.84 68.92,30.79
  vias: v1(67.53,33.11)
ATLINK_5V: length 85.4
  Top Layer w0.508: CN6.A4B9 11.8,69 v1(11.8,66.31) ; F2.1 11,65.4 v1(11,66.26) ; 6.9,66.26 6.89,66.28 CN6.B4A9
  Bottom Layer w0.381: TP3.1 12.32,65.79 v1(11.8,66.31)
  Bottom Layer w0.762: v1(11.8,66.31) 11.76,66.26 v1(11,66.26) 10.97,66.29 v1(7.21,66.29) v1(6.53,66.29) 3.91,66.29 2.86,65.24 2.86,15.17 4.54,13.49 15.44,13.49 16.21,12.73 D3.2
ATLK_BOOT0: length 10.1
  Top Layer w0.152: 6.94,33.97 6.94,25.35 7.34,24.96 7.34,24.08
ATLK_NRST: length 10.6
  Top Layer w0.152: 7.44,33.97 7.44,26.64 9.22,24.87 9.22,24.06
ATLK_RX: length 57.9
  Top Layer w0.152: 13.06,22.66 13.06,20.53 12.52,20 v1(12.52,14.7) 12.59,14.63 ; v1(7.38,14.7) 7.37,14.69 v1(7.37,9.8)
  Bottom Layer w0.152: CN7.10 5.5,2.96 5.5,7.92 v1(7.37,9.8) ; 28.03,28.64 27.38,27.98 27.38,16.21 24.99,13.82 16.51,13.82 15.63,14.7 v1(12.52,14.7) v1(7.38,14.7) ; 28.74,28.64 28.87,28.51 29.99,28.51
ATLK_SWCLK: length 10.8
  Top Layer w0.152: U6.25 5.95,27.22 3.58,24.85 3.58,24.1
ATLK_SWDIO: length 10.3
  Top Layer w0.152: 5.46,24.1 5.46,25.21 6.45,26.2 U6.26
ATLK_SWO: length 13.5
  Top Layer w0.152: 3.57,29.01 3.57,30.94 2.87,31.64 2.87,40.36 3.48,40.97 4.44,40.97
ATLK_TX: length 57.1
  Top Layer w0.152: v1(9.47,8.83) 11.12,10.48 v1(11.12,15.31) 11.12,21.49 11.13,21.49 11.13,22.66
  Bottom Layer w0.152: 6.75,1.68 7.99,2.91 7.99,7.34 v1(9.47,8.83) ; 30,31.23 29.25,31.23 29.19,31.17 CN4.8 ; v1(11.12,15.31) 11.14,15.33 15.76,15.33 16.83,14.26 24.66,14.26 26.81,16.41 26.81,29.95 28.03,31.17
BOOT0: length 144.9
  Top Layer w0.152: 74.53,50.99 74.53,53.31 72.68,55.15 v1(45.58,55.15) 43.17,57.57 43.17,67.68 ; CN7.4 13.12,2.96 13.12,4.8 12.05,5.87 11.4,5.87 8.24,9.02 8.24,20.58 7.34,21.48 7.34,22.66 ; 28.03,36.25 26.87,35.09 26.87,27.61 25.61,26.35 v1(24.96,26.35) ; v1(30.08,41.3) v1(31.88,41.3)
  Bottom Layer w0.152: 29.01,41.33 29.04,41.3 v1(30.08,41.3) ; v1(8.25,15.88) 15.87,15.88 17.11,14.64 23.91,14.64 24.96,15.69 v1(24.96,26.35) ; CN4.4 29.88,36.26 31.84,38.23 31.84,50 35.29,53.45 43.88,53.45 v1(45.58,55.15)
CAN1_RX: length 90.9
  Top Layer w0.152: v1(86.53,54.37) 87.71,55.55 112.65,55.55 v1(113.48,54.73) ; 86.53,50.99 86.53,51 86.53,54.37 ; R90.1 114.44,20.12 v1(114.42,20.09)
  Bottom Layer w0.152: v1(113.48,54.73) 113.51,54.69 113.51,21 v1(114.42,20.09) ; 86.53,54.37 86.53,57.64 84.07,60.1 82.06,60.1 81.09,61.06 81.09,63.33 80.38,64.04 79.57,64.04 78.55,65.06 74.54,65.06 73.65,65.95 J1.42
CAN1_STB: length 131.3
  Top Layer w0.152: v1(81.74,57.63) 81.79,57.58 113.14,57.58 v1(114.45,56.28) ; v1(115.17,26.08) 115.22,26.03 121.84,26.03 122.83,25.04 125.94,25.04 ; J1.65 44.47,68.93 44.47,57.69 46.65,55.51 72.89,55.51 75.03,53.37 75.03,50.99
  Bottom Layer w0.152: v1(114.45,56.28) 114.45,56.27 114.45,26.81 v1(115.17,26.08) ; v1(75.03,53.31) 76.23,53.31 80.54,57.63 v1(81.74,57.63)
CAN1_TX: length 94.9
  Top Layer w0.152: v1(113.95,55.36) 113.27,56.04 87.11,56.04 v1(86.03,54.95) ; 86.03,50.99 86.03,51 86.03,54.95 ; U9.1 114.76,25.04 v1(114.72,25.08)
  Bottom Layer w0.152: v1(113.95,55.36) 113.99,55.31 113.99,25.81 v1(114.72,25.08) ; 86.03,54.95 86.03,57.61 83.98,59.65 81.88,59.65 80.42,61.11 79.61,61.11 78.91,61.81 78.91,63.89 78.15,64.65 73.37,64.65 72.36,65.67 72.36,68.99 J1.43
CAN_H: length 17.8
  Top Layer w0.254: v1(131.11,15.9) 130.33,16.69 130.33,22.99 v1(129.54,23.77) 125.94,23.77
  Bottom Layer w0.254: v1(129.54,23.77) 129.55,23.78 131.8,23.78 CN8.2 ; v1(131.11,15.9) 131.35,15.66 R89.2
CAN_L: length 16.1
  Top Layer w0.254: SW1.1 129.54,16.1 v1(129.54,21.89) 128.12,21.89 127.51,22.5 125.94,22.5
  Bottom Layer w0.254: CN8.1 131.65,21.88 129.55,21.88 v1(129.54,21.89)
CC1: length 2.6
  Top Layer w0.152: v2(10.57,70.46) 10.59,70.44 CN6.A5
  Bottom Layer w0.152: v2(10.57,70.46) R86.1
CC2: length 2.7
  Top Layer w0.152: CN6.B5 7.59,70.39 v2(7.57,70.41)
  Bottom Layer w0.152: R87.1 7.62,71.13 7.57,71.08 v2(7.57,70.41)
EGND: length 20.8
  Top Layer w0.508: CN6.13 CN6.15 CN6.16 CN6.14
  Bottom Layer w0.508: R88.1 15.59,67.76 C20.2 13.66,68.32 CN6.13
EGND1: length 42.2
  Top Layer w0.508: CN2.15 CN2.13
  Bottom Layer w0.152: CN2.13 132.3,33.13 C21.1 132.3,29.97 R35.2
  Bottom Layer w0.508: CN1.SH1 CN1.SH2 129.74,44.73 132.23,42.25 CN2.14 CN2.16 CN2.15
LD1: length 19.3
  Top Layer w0.152: v1(15.47,52.15) 15.44,52.12 LD1.2 ; v1(15.21,44.73) 14.48,44 9.81,44 9.41,44.41 7.48,44.41 6.95,43.88 U6.10
  Bottom Layer w0.152: v1(15.47,52.15) 15.98,51.64 15.98,45.46 15.26,44.73 v1(15.21,44.73)
LD2: length 16.4
  Top Layer w0.152: v1(15.41,49.26) 15.41,49.35 14.52,50.24 ; U6.11 6.45,44.08 7.29,44.93 9.71,44.93 10.07,44.57 v1(14.12,44.57)
  Bottom Layer w0.152: v1(14.12,44.57) 15.41,45.86 v1(15.41,49.26)
LD3: length 13.3
  Top Layer w0.152: LD3.2 13.69,47.45 v1(13.68,47.45) ; U6.12 5.95,44.29 7.05,45.39 10.35,45.39 10.66,45.09 v1(11.52,45.09)
  Bottom Layer w0.152: v1(13.68,47.45) 13.68,45.71 13.06,45.09 v1(11.52,45.09)
LD4: length 17.9
  Top Layer w0.152: U6.19 5.43,37.97 5.68,38.22 5.68,41.3 5.38,41.59 5.38,44.39 6.79,45.79 11.89,45.79 12.29,45.38 13.59,45.38 14.52,46.31 14.52,46.36
M-ATLK_RX: length 12.3
  Top Layer w0.152: 12.98,24.03 12.98,24.86 8.12,29.71 8.12,31.47 8.95,32.29 U6.31
M-ATLK_TX: length 11.6
  Top Layer w0.152: 11.1,24.03 11.1,24.65 7.75,28 7.75,31.71 8.45,32.4 U6.30
M-BOOT0: length 3.9
  Top Layer w0.152: 12.95,38.97 14.76,38.97 16.25,40.46
M-NRST: length 22.7
  Top Layer w0.152: 8.45,42.47 8.45,41.12 v1(8.7,40.86) ; v1(11.5,36.17) 11.5,39.37 10.78,40.09 v1(10.04,40.09)
  Bottom Layer w0.152: P1.4 12.19,27.13 12.19,35.48 v1(11.5,36.17) ; C22.2 10.02,40.11 v1(10.04,40.09)
  Bottom Layer w0.254: v1(8.7,40.86) 8.75,40.82 C22.2
M-SWCLK: length 12.1
  Top Layer w0.152: U6.37 14.1,35.47 v1(14.6,34.97)
  Bottom Layer w0.152: P1.3 13.05,28.82 13.05,32.29 14.6,33.84 v1(14.6,34.97)
M-SWDIO: length 9.6
  Top Layer w0.152: P1.2 11.27,28.94 10.44,29.77 10.44,33.97
M-USB_DM: length 39.6
  Top Layer w0.152: R12.2 9.16,61.77 v1(9.14,61.75) ; 9.17,31.59 9.45,31.86 U6.32
  Bottom Layer w0.152: v1(9.17,31.58) 8.96,31.38 7.08,31.38 4.91,33.55 4.91,48.59 8.66,52.34 8.66,61.27 v1(9.14,61.75)
M-USB_DP: length 40.9
  Top Layer w0.152: v1(7.88,61.74) 7.84,61.78 R11.2 ; 9.85,31.41 9.95,31.5 U6.33
  Bottom Layer w0.152: v1(7.88,61.74) 8.35,61.26 8.35,52.47 4.6,48.72 4.6,33.42 6.95,31.07 9.52,31.07 v1(9.85,31.4)
NRST: length 178.1
  Top Layer w0.152: J7.5 95.4,37.23 94.75,36.58 v1(94,36.58) ; v2(9.22,16.37) 9.22,16.82 ; 9.22,16.82 9.22,22.66 ; 9.22,16.82 9.23,16.83 9.23,9.74 v1(9.22,9.73) ; 63.81,20.25 63.81,11.23 64.79,10.24 64.79,8.01 J2.25 ; 63.81,20.25 63.81,34.63 66.3,37.12 74,37.12 74.09,37.22 86.99,37.22 88.87,35.34 v1(89.45,35.34) ; 63.81,20.25 63.76,20.2 63.76,20.18 42.03,20.18 39.77,17.92 C40.1 34.76,18.75 31.89,18.75 31.62,18.48 22.82,18.48 22.82,17.11 20.55,14.83 17.86,14.83 v1(17.44,15.25)
  Bottom Layer w0.152: 73.92,14.36 73.92,12.82 72.99,11.9 68.52,11.9 67.3,10.68 67.3,8.04 J2.25 ; v1(17.44,15.25) 16.32,16.37 v2(9.22,16.37) ; v1(94,36.58) 92.75,35.34 v1(89.45,35.34) ; v1(9.22,9.73) 6.75,7.26 6.75,4.22 ; CN4.7 24.12,29.8 v1(24.12,18.47)
OTGFS1_D+: length 35.7
  Top Layer w0.152: R30.2 123.33,55.1 126.15,55.1 127.03,55.98 127.24,55.98 128.08,55.14 133.89,55.14 135.11,53.92 135.11,38.48 134.31,37.68 v1(133.61,37.68) CN2.A6 ; CN2.B6 v1(133.66,38.68)
  Bottom Layer w0.152: v1(133.61,37.68) 133.61,38.63 v1(133.66,38.68)
OTGFS1_D-: length 35.8
  Top Layer w0.152: R31.2 122.71,54.03 123.48,54.8 126.21,54.8 127.03,53.98 127.24,53.98 128.1,54.84 133.77,54.84 134.81,53.8 134.81,38.61 134.39,38.19 131.88,38.19 CN2.A7 130.48,38.18 130.21,37.9 130.21,37.47 130.5,37.18 CN2.B7
PA0: length 81.7
  Top Layer w0.152: U1.34 67.65,32.62 66.87,31.84 66.87,22.5 67.4,21.97 67.4,18.42 70.17,15.66 70.17,13.29 70.81,12.66 73.5,12.66 76.19,9.97 J2.34 ; v1(62.52,19.54) 42.46,19.54 40.01,17.1 37.14,17.1 36.64,16.6 35.64,16.6
  Bottom Layer w0.152: v1(62.52,19.54) v1(67.4,19.54) ; J2.34 79.47,12.58 88.31,12.58 90.09,14.36 91.7,14.36
PA1: length 55.4
  Top Layer w0.152: J2.35 77.44,8.06 77.44,11.26 75.35,13.34 75.35,15.27 74.63,16 70.61,16 68.12,18.49 68.12,21.87 67.69,22.3 67.69,31.63 68.18,32.12 U1.35
  Bottom Layer w0.152: 94.24,14.36 94.24,13.03 93.23,12.02 80.59,12.02 79.98,11.41 79.98,8.01 J2.35
PA2: length 89.6
  Top Layer w0.152: v1(89.99,59.11) 90.52,59.11 90.67,59.27 100.11,59.27 101.86,61.02 J5.2 ; 85.23,33.05 73.03,33.05 71.59,31.62 U1.36 68.85,31.62 68.55,31.32 68.55,22.11 68.78,21.88 68.78,18.57 70.96,16.39 77.03,16.39 77.69,15.73 77.69,12.89 78.73,11.85 J2.36
  Bottom Layer w0.152: v1(85.23,33.05) 85.23,46.48 90.03,51.28 90.03,57.89 90.12,57.98 90.12,58.62 90.03,58.71 90.03,59.08 v1(89.99,59.11)
PA3: length 90.6
  Top Layer w0.152: 89.57,58.41 90.63,58.41 90.95,58.73 100.51,58.73 J5.1 ; J2.37 79.98,8.06 79.98,12.53 80.33,12.89 80.33,15.58 79.11,16.8 72.65,16.8 71.53,17.93 71.53,31.04 73.04,32.55 v1(84.65,32.55)
  Bottom Layer w0.152: v1(84.65,32.55) 84.65,46.45 89.59,51.39 89.59,58.39 v1(89.57,58.41)
PA4: length 45.2
  Top Layer w0.152: 73.03,29.75 73.03,18.48 74.34,17.17 80.75,17.17 82.57,15.35 82.57,12.21 83.81,10.96 J2.40
  Bottom Layer w0.152: J2.40 83.81,10.73 84.6,11.52 95.06,11.52 96.78,13.23 96.78,14.36
PA5: length 66.7
  Top Layer w0.152: v1(74.07,31.6) 74.07,31.58 73.53,31.04 73.53,19.33 75.33,17.54 81.24,17.54 82.97,15.81 82.97,12.63 85.06,10.55 85.06,8.06 J2.41
  Bottom Layer w0.152: v1(74.07,31.6) 74.16,31.69 74.16,49.89 72.2,51.85 72.2,59.22 69.86,61.56 69.86,62.62
PA6: length 64.5
  Top Layer w0.152: J2.42 86.35,10.85 85.16,12.05 85.16,17.41 84.65,17.92 76.24,17.92 74.03,20.13 74.03,30.83 74.64,31.44 v1(74.64,32.02)
  Bottom Layer w0.152: v1(74.64,32.02) 74.64,49.99 72.59,52.04 72.59,60.99 72.4,61.18 72.4,62.62
PA7: length 68.5
  Top Layer w0.152: J2.43 87.6,8.06 87.6,10.45 85.62,12.43 85.62,17.64 84.88,18.37 76.84,18.37 74.53,20.68 74.53,30.71 75.1,31.28 v1(75.12,31.28)
  Bottom Layer w0.152: v1(75.12,31.28) 75.12,50.09 72.97,52.24 72.97,59.47 74.94,61.44 74.94,62.62
PA8: length 36.4
  Top Layer w0.152: J1.28 88.73,64.99 87.28,64.99 86.62,64.33 J5.8 ; 90.91,45.12 93.31,45.12 v1(94.68,46.49)
  Bottom Layer w0.152: J1.28 92.28,66.84 92.28,65.34 92.87,64.75 94.61,64.75 95.38,63.98 95.38,47.19 v1(94.68,46.49)
PA9: length 176.6
  Top Layer w0.152: 62.27,24.65 32.57,24.65 31.39,25.83 v1(31.39,27.11) ; v1(95.69,27.68) 95.71,27.66 98.2,27.66 98.38,27.48 110.14,27.48 v1(110.16,27.5) ; J1.29 87.6,68.94 87.6,66.13 86.78,65.31 83.63,65.31 82.56,64.24 82.56,62.62 ; v1(111.43,42.37) JP4.1 ; v1(111.43,49.01) 111.42,49.01 110.11,50.31 104.88,50.31 101.53,46.97 94.3,46.97 92.95,45.62 90.91,45.62
  Bottom Layer w0.152: J1.29 90.14,68.99 90.14,66.64 93.19,63.6 93.19,61.37 95.01,59.54 95.01,47.69 93.95,46.62 ; v1(31.39,27.11) 31.38,27.12 31.38,28.51 ; v1(111.43,49.01) 111.43,49 v1(111.43,42.37) 111.43,28.77 v1(110.16,27.5) ; v1(62.27,24.65) 92.66,24.65 v1(95.69,27.68)
  vias: v1(93.95,46.62)
PA10: length 160.9
  Top Layer w0.152: v1(93.6,59.89) 98.41,59.89 99.32,60.81 J5.3 ; v1(110.11,28.31) 109.62,27.81 98.66,27.81 98.32,28.15 95.33,28.15 v1(94.87,27.69) ; v1(62.91,25.16) 33.82,25.16 32.71,26.27 v1(32.71,30.34) ; 90.91,46.12 92.68,46.12 v1(94,47.43) ; 94,47.43 101.56,47.43 104.68,50.55 104.69,50.55 104.75,50.62 110.24,50.62 110.3,50.55 110.63,50.55 v1(110.9,50.28)
  Bottom Layer w0.152: v1(94,47.43) 94.63,48.07 94.63,58.86 v1(93.6,59.9) 92.76,60.74 92.76,63.41 91.65,64.52 90.72,64.52 88.89,66.35 J1.30 ; 31.4,31.23 31.82,31.23 32.71,30.34 ; v1(94.87,27.69) 92.33,25.16 v1(62.91,25.16) ; v1(110.9,50.28) 110.92,50.26 110.92,29.12 v1(110.11,28.31)
PA11: length 39.9
  Top Layer w0.152: 90.91,46.62 92.3,46.62 94.06,48.38 v1(94.06,48.4) 94.56,48.4 94.75,48.59 101.08,48.59 103.92,51.43 115.74,51.43 119.06,54.75 120.51,54.75 121.2,54.06 R31.1
  Bottom Layer w0.152: 94.06,48.4 94.06,50.71 93.25,51.52 93.25,52.55 93.47,52.77 R54.2 ; 94.05,48.6 94.06,48.59 v1(94.06,48.4)
PA11_E: length 18.4
  Bottom Layer w0.152: 93.44,54.73 93.44,58.88 90.63,61.69 90.63,63.91 87.65,66.89 87.65,68.93 J1.31
PA12: length 39.9
  Top Layer w0.152: 93.57,48.91 93.57,48.31 92.37,47.12 90.91,47.12 ; 93.57,48.91 v1(93.55,48.93) ; 93.57,48.91 93.59,48.89 100.95,48.89 103.81,51.75 115.64,51.75 118.94,55.05 120.56,55.05 121.2,55.7 R30.1
  Bottom Layer w0.152: 91.93,53.31 91.93,53.34 ; 91.93,53.34 92.95,52.32 92.95,51.39 93.74,50.6 93.74,49.39 93.55,49.2 v1(93.55,48.93) ; 91.93,53.34 R55.2
PA12_E: length 15.3
  Bottom Layer w0.152: J1.32 86.35,67.57 90.26,63.66 90.26,61.43 91.96,59.72 91.96,54.73
PA13/SWDIO: length 161.5
  Top Layer w0.152: v1(93,50.28) 93,48.41 92.2,47.62 U1.105 88.98,47.62 87.78,48.83 72.01,48.83 70.19,50.65 34.23,50.65 v1(31.21,47.63) ; 5.46,22.56 5.46,20.49 v1(6.63,19.32) 6.63,9.42 CN7.3
  Bottom Layer w0.152: v1(93,50.28) 93,50.36 90.86,52.5 90.86,59.62 89.95,60.53 89.07,60.53 88.09,61.51 88.09,64.04 85.11,67.02 85.11,68.93 J1.33 ; v1(6.63,19.32) 6.85,19.1 21.95,19.1 22.93,20.08 22.93,34.75 24.43,36.26 CN4.3 ; 25.49,36.25 26.45,37.23 26.76,37.52 29.02,37.52 31.21,39.7 v1(31.21,47.63)
PA14/SWCLK: length 159.8
  Top Layer w0.152: 32.48,49.67 33.77,50.96 70.35,50.96 72.18,49.13 87.98,49.13 89.03,50.18 89.03,50.99 89.04,51.01 89.04,52.36 ; 3.58,22.56 3.58,21.09 v1(5.87,18.8) 5.9,18.76 5.9,8.78 9.29,5.39 CN7.5
  Bottom Layer w0.152: J1.37 79.98,68.99 79.98,66.99 80.69,66.28 83.94,66.28 85.26,64.96 85.26,61.82 89.04,58.04 89.04,52.36 ; 24.16,33.72 CN4.5 25.49,33.78 26.8,35.09 30.41,35.09 32.48,37.15 32.48,49.67 ; 24.12,33.72 23.26,32.85 23.26,19.7 22.15,18.59 6.07,18.59 v1(5.87,18.8)
  vias: v1(32.48,49.67) v1(89.04,52.36)
PA15: length 32.1
  Top Layer w0.152: 88.53,52.92 88.53,51 88.53,50.99 ; v1(79.61,60.06) 81.31,61.76 81.31,63.89 82.18,64.76 v1(82.18,65.77)
  Bottom Layer w0.152: v1(79.61,60.06) 78.15,58.59 77.46,58.59 ; J1.38 80.65,65.77 v1(82.18,65.77) 83.74,65.77 84.85,64.65 84.85,61.61 88.53,57.93 88.53,52.92
  vias: v1(88.54,52.92)
PB0: length 42.8
  Top Layer w0.152: 76.03,29.75 76.03,21.89 78.36,19.55 87.2,19.55 89.42,17.34 89.42,13.02 91.43,11.01 J2.46
  Bottom Layer w0.152: J2.46 93.23,11.11 97.5,11.11 99.32,12.93 99.32,14.36
PB1: length 35.5
  Top Layer w0.152: 76.53,29.75 76.53,22.16 78.75,19.94 87.79,19.94 89.99,17.73 89.99,13.44 92.68,10.75 92.68,8.06 J2.47
PB2/BOOT1: length 99.5
  Top Layer w0.152: 30.32,42.73 31.98,42.73 33.44,41.27 v1(33.44,40.69) ; 77.03,29.75 77.03,29.75 v1(77.03,23.63) 77.03,22.44 79.16,20.31 89.12,20.31 92.98,16.44 92.98,12.53 93.97,11.54 J2.48 ; v1(63.08,23.66) v1(33.49,23.66)
  Bottom Layer w0.152: v1(77.03,23.63) 63.11,23.63 v1(63.08,23.66) ; 30.32,42.73 29.04,42.76 ; v1(33.49,23.66) 33.44,23.71 v1(33.44,40.69)
  vias: v1(30.32,42.73)
PB3: length 107.7
  Top Layer w0.152: v1(76.86,54.84) 74.56,57.13 51.38,57.13 50.66,57.86 50.66,57.84 v1(50.65,57.84) 49.5,58.99 49.5,68.99 J1.61 ; 77.03,50.99 77.03,54.67 76.86,54.84 ; v1(80.62,58.57) 81.93,59.88 92.45,59.88 93.08,60.52 96.25,60.52 96.78,61.04 J5.4
  Bottom Layer w0.152: v1(76.86,54.84) 80.6,58.57 v1(80.62,58.57) ; v1(50.65,57.84) 50.63,57.84 49.5,56.7 49.5,54.29 47.95,52.75 36.42,52.75 32.88,49.2 32.88,36.41 31.45,34.97 31.45,33.67
PB4: length 62.6
  Top Layer w0.152: 76.53,50.99 76.52,51 76.52,54.34 v1(75.62,55.24) 74.13,56.73 50,56.73 48.18,58.56 48.18,67.62 J1.62 ; 79.78,59.35 81.14,60.72 91.29,60.72 91.7,61.12 J5.6
  Bottom Layer w0.152: v1(75.62,55.24) 75.67,55.24 v1(79.78,59.36)
PB5: length 68.6
  Top Layer w0.152: J5.5 91.96,60.34 81.56,60.34 80.6,59.37 ; 76.03,50.99 76.03,54 v1(75.78,54.25) 73.71,56.32 48.58,56.32 46.96,57.95 46.96,68.99 J1.63
  Bottom Layer w0.152: v1(80.6,59.38) 80.6,59.36 76.24,55 76.24,54.71 v1(75.78,54.25)
PB6: length 49.2
  Top Layer w0.152: 75.53,50.99 75.53,53.63 74.97,54.19 73.24,55.91 47.41,55.91 45.71,57.62 J1.64
  Bottom Layer w0.152: 74.97,54.19 74.97,55.47 76.11,56.61 76.11,58.73
  vias: v1(74.97,54.19)
PB8: length 139.3
  Top Layer w0.152: 40.63,70.22 41.88,68.99 41.88,57.84 45.08,54.64 v1(59.71,54.64) 72.38,54.64 74.02,53.01 74.02,51.01 74.03,50.99 ; v1(82.3,57.1) 112.53,57.1 v1(112.99,56.64)
  Bottom Layer w0.152: v1(74.02,53.01) 74.55,53.01 74.73,52.83 76.23,52.83 80.49,57.1 v1(82.3,57.1) ; R58.1 105.85,19.44 112.99,26.57 112.99,56.63 v1(112.99,56.64) ; 59.7,54.64 59.7,60.79 59.7,60.8 59.7,62.62
